# EAGLE design CM FT4232 with RS485 and ESP32 (EAGLE 9.6.2)
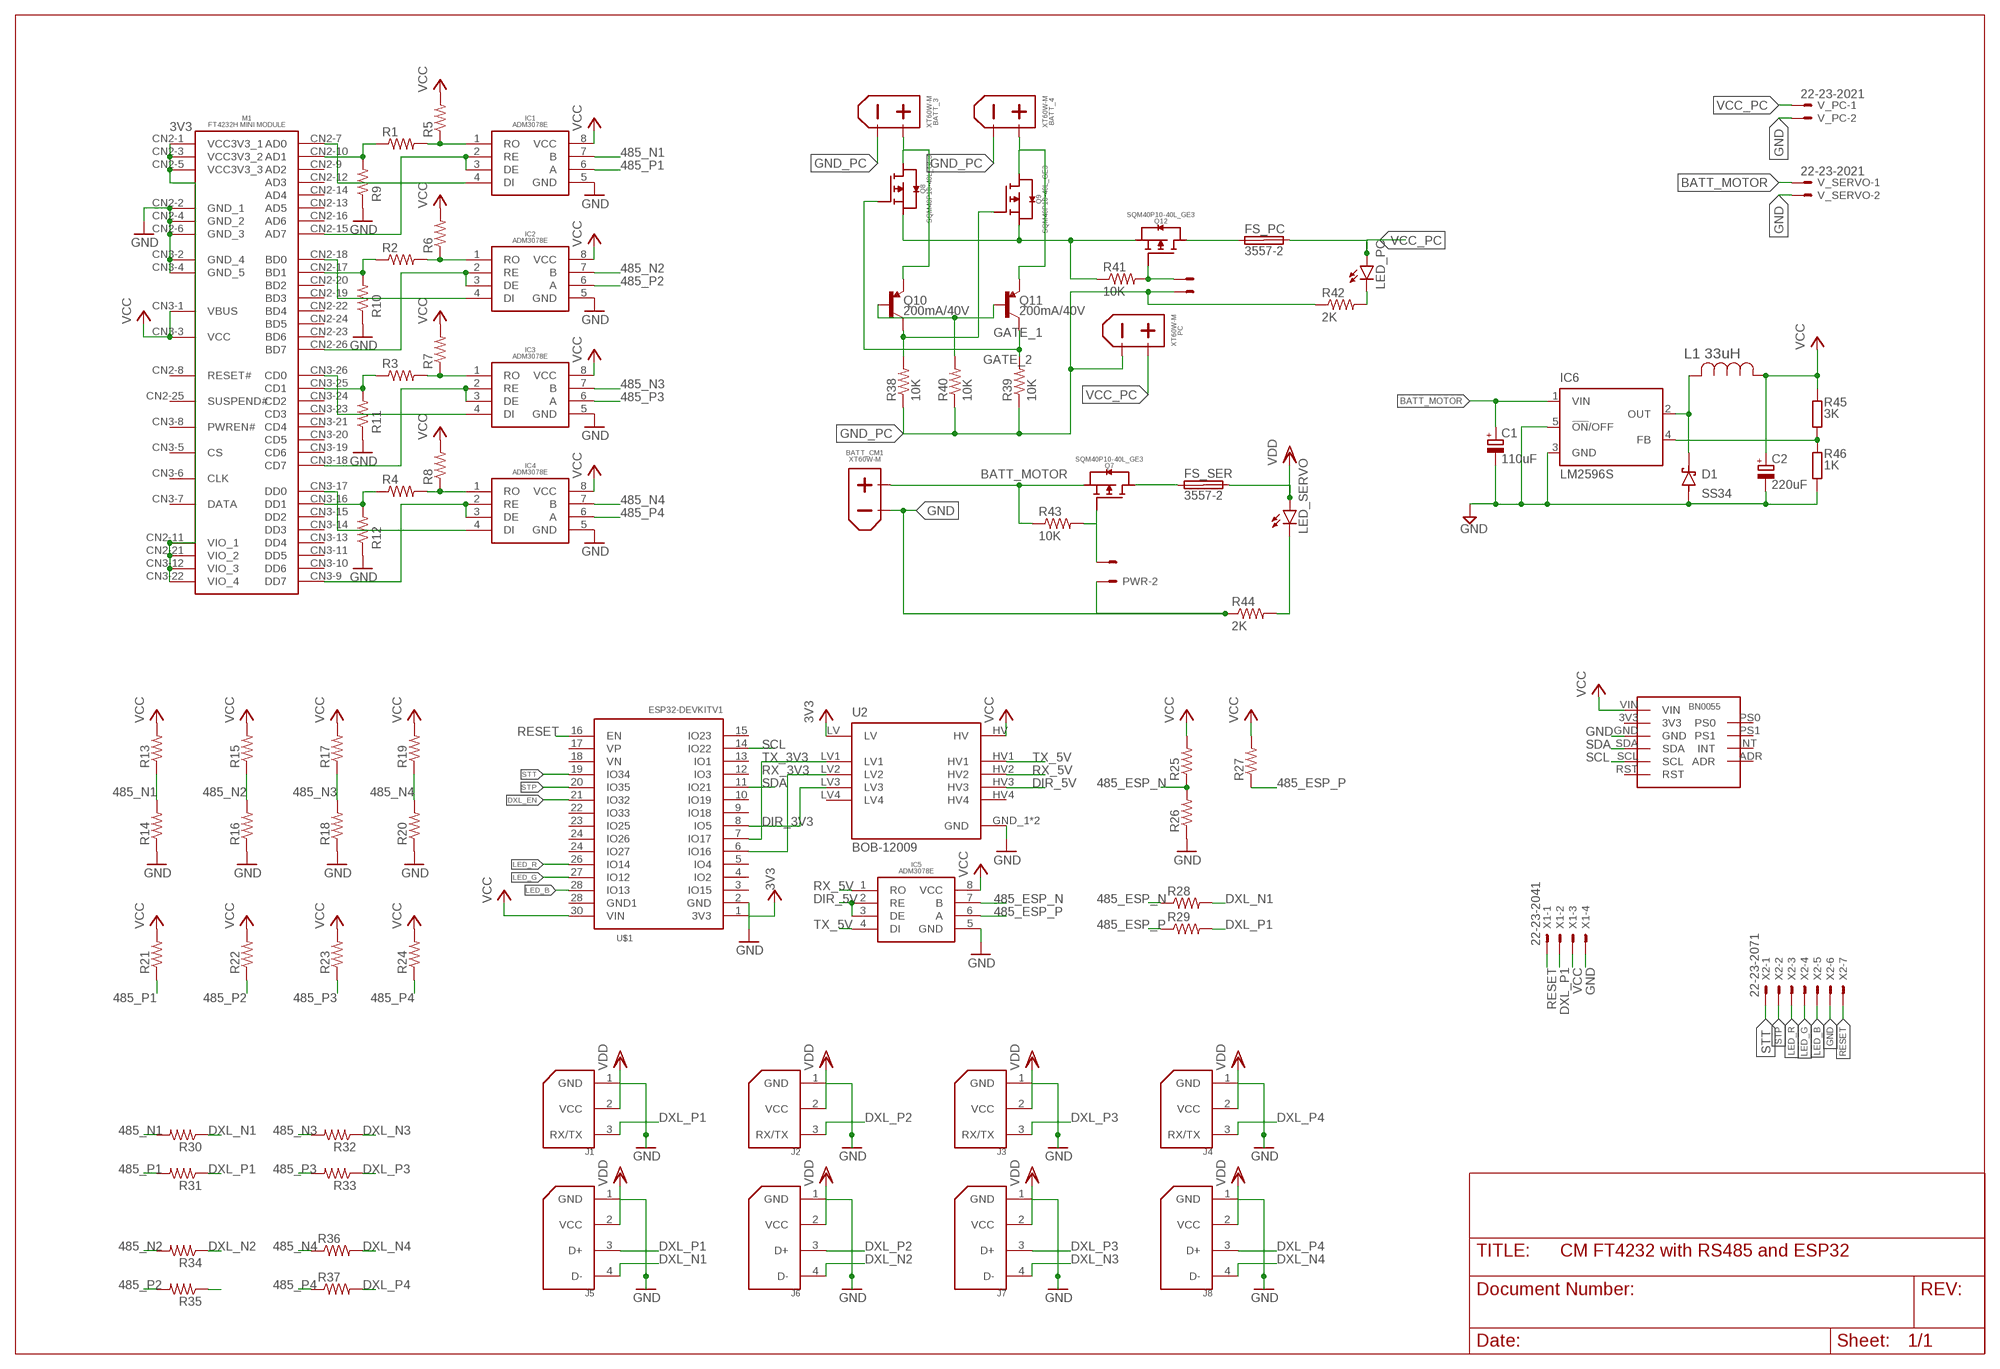
[diagram p0: schematic, sheet 1]

## Parts
BATT_3  XT60PW-M  [XT60PW-M]
BATT_4  XT60PW-M  [XT60PW-M]
BATT_CM1  XT60PW-M  [XT60PW-M]
C1  110uF  CPOL-EUE2.5-6  [E2,5-6]
C2  220uF  CPOL-EUE2.5-6  [E2,5-6]
D1  SS34  [DIOM6859X262N]
FS_PC  3557-2  [FUSE_3557-2]
FS_SER  3557-2  [FUSE_3557-2]
IC1  ADM3078E  [ADM3078E]
IC2  ADM3078E  [ADM3078E]
IC3  ADM3078E  [ADM3078E]
IC4  ADM3078E  [ADM3078E]
IC5  ADM3078E  [ADM3078E]
IC6  LM2596S  [TO263-5]
J1  22-03-5035  [5267-3]
J2  22-03-5035  [5267-3]
J3  22-03-5035  [5267-3]
J4  22-03-5035  [5267-3]
J5  22-03-5045  [5267-4]
J6  22-03-5045  [5267-4]
J7  22-03-5045  [5267-4]
J8  22-03-5045  [5267-4]
L1  33uH  CDRH127/LDNP-470MC  [IND_CDRH127/LDNP-470MC_SUM]
LED_PC  LEDCHIPLED_0805  [CHIPLED_0805]
LED_SERVO  LEDCHIPLED_0805  [CHIPLED_0805]
M1  FT4232H_MINI_MODULE  [FT4232H_MINI_MODULE]
PC  XT60PW-M  [XT60PW-M]
PWR  22-23-2021  [22-23-2021]
Q7  SQM40P10-40L_GE3  [TO-252-3]
Q8  SQM40P10-40L_GE3  [TO-252-3]
Q9  SQM40P10-40L_GE3  [TO-252-3]
Q10  200mA/40V  TRANS_PNP-PMBT3906|MMBT3906L  [SOT23-3]
Q11  200mA/40V  TRANS_PNP-PMBT3906|MMBT3906L  [SOT23-3]
Q12  SQM40P10-40L_GE3  [TO-252-3]
R1  RESISTOR0805  [0805]
R2  RESISTOR0805  [0805]
R3  RESISTOR0805  [0805]
R4  RESISTOR0805  [0805]
R5  RESISTOR0805  [0805]
R6  RESISTOR0805  [0805]
R7  RESISTOR0805  [0805]
R8  RESISTOR0805  [0805]
R9  RESISTOR0805  [0805]
R10  RESISTOR0805  [0805]
R11  RESISTOR0805  [0805]
R12  RESISTOR0805  [0805]
R13  RESISTOR0805  [0805]
R14  RESISTOR0805  [0805]
R15  RESISTOR0805  [0805]
R16  RESISTOR0805  [0805]
R17  RESISTOR0805  [0805]
R18  RESISTOR0805  [0805]
R19  RESISTOR0805  [0805]
R20  RESISTOR0805  [0805]
R21  RESISTOR0805  [0805]
R22  RESISTOR0805  [0805]
R23  RESISTOR0805  [0805]
R24  RESISTOR0805  [0805]
R25  RESISTOR0805  [0805]
R26  RESISTOR0805  [0805]
R27  RESISTOR0805  [0805]
R28  RESISTOR0805  [0805]
R29  RESISTOR0805  [0805]
R30  RESISTOR0805  [0805]
R31  RESISTOR0805  [0805]
R32  RESISTOR0805  [0805]
R33  RESISTOR0805  [0805]
R34  RESISTOR0805  [0805]
R35  RESISTOR0805  [0805]
R36  RESISTOR0805  [0805]
R37  RESISTOR0805  [0805]
R38  10K  R-US_M0805  [M0805]
R39  10K  R-US_M0805  [M0805]
R40  10K  R-US_M0805  [M0805]
R41  10K  R-US_M0805  [M0805]
R42  2K  R-US_M0805  [M0805]
R43  10K  R-US_M0805  [M0805]
R44  2K  R-US_M0805  [M0805]
R45  3K  R-EU_R1206  [R1206]
R46  1K  R-EU_R1206  [R1206]
SW_PC  22-23-2021  [22-23-2021]
U2  BOB-12009  [CONV_BOB-12009]
U$1  ESP32DEVKITV1  [ESP32-DEVKITV1]
U$2  BNO055  [BNO055]
V_PC  22-23-2021  [22-23-2021]
V_SERVO  22-23-2021  [22-23-2021]
X1  22-23-2041  [22-23-2041]
X2  22-23-2071  [22-23-2071]

## Nets
3V3: M1.CN2-1(VCC3V3_1) M1.CN2-3(VCC3V3_2) M1.CN2-5(VCC3V3_3) M1.CN2-11(VIO_1) M1.CN2-21(VIO_2) M1.CN3-12(VIO_3) M1.CN3-22(VIO_4) U2.LV U$1.1(3V3) ; supply symbol labelled VCC
485_ESP_N: IC5.7(B) R25.1 R26.2 R28.1
485_ESP_P: IC5.6(A) R27.1 R29.1
485_N1: IC1.7(B) R13.1 R14.2 R30.2
485_N2: IC2.7(B) R15.1 R16.2 R34.2
485_N3: IC3.7(B) R17.1 R18.2 R32.2
485_N4: IC4.7(B) R19.1 R20.2 R36.1
485_P1: IC1.6(A) R21.1 R31.2
485_P2: IC2.6(A) R22.1 R35.2
485_P3: IC3.6(A) R23.1 R33.2
485_P4: IC4.6(A) R24.1 R37.1
+3: Q8.3(S) Q9.3(S) Q12.3(S) R41.1
BATT_MOTOR: BATT_CM1.+ C1.+ IC6.1(VIN) Q7.3(S) R43.1 V_SERVO.1
DI1: IC1.4(DI) M1.CN2-7(AD0)
DIR_3V3: U2.LV3 U$1.8(IO5)
DIR_5V: IC5.2(RE) IC5.3(DE) U2.HV3
DXL_EN: U$1.21(IO32)
DXL_N1: J5.4(D-) R28.2 R30.1
DXL_N2: J6.4(D-) R34.1
DXL_N3: J7.4(D-) R32.1
DXL_N4: J8.4(D-) R36.2
DXL_P1: J1.3(RX/TX) J5.3(D+) R29.2 R31.1 X1.2
DXL_P2: J2.3(RX/TX) J6.3(D+) R35.1
DXL_P3: J3.3(RX/TX) J7.3(D+) R33.1
DXL_P4: J4.3(RX/TX) J8.3(D+) R37.2
GATE_1: Q9.1(G) Q10.3(C) R38.2
GATE_2: Q8.1(G) Q11.3(C) R39.2
GND: BATT_CM1.1(-) BATT_CM1.2(-) BATT_CM1.- C1.- C2.- D1.A IC1.5(GND) IC2.5(GND) IC3.5(GND) IC4.5(GND) IC5.5(GND) IC6.3(GND) IC6.5(!ON!/OFF) J1.1(GND) J2.1(GND) J3.1(GND) J4.1(GND) J5.1(GND) J6.1(GND) J7.1(GND) J8.1(GND) M1.CN2-2(GND_1) M1.CN2-4(GND_2) M1.CN2-6(GND_3) M1.CN3-2(GND_4) M1.CN3-4(GND_5) PWR.2 R9.1 R10.1 R11.1 R12.1 R14.1 R16.1 R18.1 R20.1 R26.1 R44.1 R46.1 U2.GND_1(GND) U2.GND_2(GND) U$1.2(GND) U$2.GND V_PC.2 V_SERVO.2 X1.4 X2.6
GND_PC: BATT_3.1(-) BATT_3.2(-) BATT_3.- BATT_4.1(-) BATT_4.2(-) BATT_4.- PC.1(-) PC.2(-) PC.- R38.1 R39.1 R40.1 R42.1 SW_PC.2
LED_B: U$1.28(IO13) X2.5
LED_G: U$1.27(IO12) X2.4
LED_R: U$1.26(IO14) X2.3
N$1: FS_PC.1(1A) Q12.4(D)
N$2: IC2.2(RE) IC2.3(DE) M1.CN2-26(BD7)
N$3: IC3.2(RE) IC3.3(DE) M1.CN3-18(CD7)
N$4: IC4.2(RE) IC4.3(DE) M1.CN3-9(DD7)
N$5: M1.CN2-10(AD1) R1.1 R9.2
N$6: FS_SER.1(1A) Q7.4(D)
N$7: M1.CN2-17(BD1) R2.1 R10.2
N$8: IC2.1(RO) R2.2 R6.1
N$9: IC3.1(RO) R3.2 R7.1
N$10: M1.CN3-25(CD1) R3.1 R11.2
N$11: M1.CN3-16(DD1) R4.1 R12.2
N$12: IC4.1(RO) R4.2 R8.1
N$14: IC2.4(DI) M1.CN2-18(BD0)
N$15: IC3.4(DI) M1.CN3-26(CD0)
N$16: IC4.4(DI) M1.CN3-17(DD0)
N$17: BATT_3.+ Q8.4(D) Q10.2(E)
N$18: BATT_4.+ Q9.4(D) Q11.2(E)
N$22: Q10.1(B) Q11.1(B) R40.2
N$23: Q12.1(G) R41.2 SW_PC.1
N$24: PWR.1 Q7.1(G) R43.2
N$25: LED_PC.C R42.2
N$26: LED_SERVO.C R44.2
N$27: IC6.4(FB) R45.1 R46.2
N$28: D1.C(K) IC6.2(OUT) L1.2
RE1: IC1.2(RE) IC1.3(DE) M1.CN2-15(AD7)
RESET: U$1.16(EN) X1.1 X2.7
RO1: IC1.1(RO) R1.2 R5.1
RX_3V3: U2.LV2 U$1.6(IO16)
RX_5V: IC5.1(RO) U2.HV2
SCL: U$1.14(IO22) U$2.SCL
SDA: U$1.11(IO21) U$2.SDA
STP: U$1.20(IO35) X2.2
STT: U$1.19(IO34) X2.1
TX_3V3: U2.LV1 U$1.7(IO17)
TX_5V: IC5.4(DI) U2.HV1
VCC: C2.+ IC1.8(VCC) IC2.8(VCC) IC3.8(VCC) IC4.8(VCC) IC5.8(VCC) L1.1 M1.CN3-1(VBUS) M1.CN3-3(VCC) R5.2 R6.2 R7.2 R8.2 R13.2 R15.2 R17.2 R19.2 R21.2 R22.2 R23.2 R24.2 R25.2 R27.2 R45.2 U2.HV U$1.30(VIN) U$2.VIN X1.3
VCC_PC: FS_PC.3(2A) LED_PC.A PC.+ V_PC.1
VDD: FS_SER.3(2A) J1.2(VCC) J2.2(VCC) J3.2(VCC) J4.2(VCC) J5.2(VCC) J6.2(VCC) J7.2(VCC) J8.2(VCC) LED_SERVO.A
Unconnected: FS_PC.2(1B) FS_PC.4(2B) FS_SER.2(1B) FS_SER.4(2B) M1.CN2-8(RESET#) M1.CN2-9(AD2) M1.CN2-12(AD3) M1.CN2-13(AD5) M1.CN2-14(AD4) M1.CN2-16(AD6) M1.CN2-19(BD3) M1.CN2-20(BD2) M1.CN2-22(BD4) M1.CN2-23(BD6) M1.CN2-24(BD5) M1.CN2-25(SUSPEND#) M1.CN3-5(CS) M1.CN3-6(CLK) M1.CN3-7(DATA) M1.CN3-8(PWREN#) M1.CN3-10(DD6) M1.CN3-11(DD5) M1.CN3-13(DD4) M1.CN3-14(DD3) M1.CN3-15(DD2) M1.CN3-19(CD6) M1.CN3-20(CD5) M1.CN3-21(CD4) M1.CN3-23(CD3) M1.CN3-24(CD2) U2.HV4 U2.LV4 U$1.3(IO15) U$1.4(IO2) U$1.5(IO4) U$1.9(IO18) U$1.10(IO19) U$1.12(IO3) U$1.13(IO1) U$1.15(IO23) U$1.17(VP) U$1.18(VN) U$1.22(IO33) U$1.23(IO25) U$1.24(IO26) U$1.24(IO27) U$1.28(GND1) U$2.3V3 U$2.ADR U$2.INT U$2.PS0 U$2.PS1 U$2.RST

## Library data of the parts
BATT_3 BATT_4 BATT_CM1 PC = AMASS_XT60:XT60PW-M
C1 C2 = rcl:CPOL-EU: POLARIZED CAPACITOR, European symbol; SPICEPREFIX: C
D1 = SS34:SS34: Check availability <https://pricing.snapeda.com/parts/SS34/Taiwan%20Semiconductor/view-part?ref=eda>; AVAILABILITY: In Stock; DESCRIPTION: 3A, 40V, Schottky Rectifier; MF: Taiwan Semiconductor; MP: SS34; PACKAGE: SMC-2 Taiwan Semiconductor; PRICE: None; PURCHASE-URL: https://pricing.snapeda.com/search/part/SS34/?ref=eda
FS_PC FS_SER = 3557-2:3557-2: Clip; Auto Clips & Holders; 2-1 Holder For Standard & Low Profile Mini Fuses Check availability <https://pricing.snapeda.com/parts/3557-2/Keystone%20Electronics/view-part?ref=eda>; AVAILABILITY: In Stock; DESCRIPTION: THM 2 in 1 Auto Blade Holder; MF: Keystone Electronics; MP: 3557-2; PACKAGE: Nonstandard Keystone; PRICE: None; PURCHASE-URL: https://pricing.snapeda.com/search/part/3557-2/?ref=eda
IC1-IC5 = ADM3078E:ADM3078E
IC6 = national-semiconductor:LM2596: SIMPLE SWITCHER® Power Converter 150 kHz 3A Step-Down Voltage Regulator Source: http://www.national.com/ds/LM/LM2596.pdf; MF: NATIONAL SEMICONDUCTOR; MPN: LM2596S-ADJ/NOPB; OC_FARNELL: 9494367; OC_NEWARK: 41K3842
J1-J4 = molex:22-03-5035: Molex SPOX Vert, Tin (Dynamixel AX/MX Bus) tested: YES (arbotix)
J5-J8 = molex:22-03-5045: Molex SPOX Vert, Tin (Dynamixel RX Bus) tested: YES (arbotix2)
L1 = CDRH127_LDNP-470MC:CDRH127/LDNP-470MC: Check availability <https://pricing.snapeda.com/parts/CDRH127/LDNP-470MC/Sumida%20America/view-part?ref=eda>; AVAILABILITY: In Stock; DESCRIPTION: 47 µH Shielded - Inductor 3.25 A 78mOhm Max Nonstandard; MF: Sumida America; MP: CDRH127/LDNP-470MC; PACKAGE: Nonstandard Sumida; PRICE: None; PURCHASE-URL: https://pricing.snapeda.com/search/part/CDRH127/LDNP-470MC/?ref=eda
LED_PC LED_SERVO = led:LED: LED OSRAM: - CHIPLED LG R971, LG N971, LY N971, LG Q971, LY Q971, LO R971, LY R971 LH N974, LH R974 LS Q976, LO Q976, LY Q976 LO Q996 - Hyper CHIPLED LW Q18S LB Q993, LB Q99A, LB R99A - SideLED LS A670, LO A670, LY A670, LG A670, LP A670 LB A673, LV A673, LT A673, LW A673 LH A674 LY A675 LS A676, LA A676, LO A676, LY A676, LW A676 LS A679, LY A679, LG A679 - Hyper Micro SIDELED® LS Y876, LA Y876, LO Y876, LY Y876 LT Y87S - SmartLED LW L88C, LW L88S LB L89C, LB L89S, LG L890 LS L89K, LO L89K, LY L89K LS L896, LA L896, LO L896, LY L896 - TOPLED LS T670, LO T670, LY T670, LG T670, LP T670 LSG T670, LSP T670, LSY T670, LOP T670, LYG T670 LG T671, LOG T671, LSG T671 LB T673, LV T673, LT T673, LW T673 LH T674 LS T676, LA T676, LO T676, LY T676, LB T676, LH T676, LSB T676, LW T676 LB T67C, LV T67C, LT T67C, LS T67K, LO T67K, LY T67K, LW E67C LS E67B, LA E67B, LO E67B, LY E67B, LB E67C, LV E67C, LT E67C LW T67C LS T679, LY T679, LG T679 LS T770, LO T770, LY T770, LG T770, LP T770 LB T773, LV T773, LT T773, LW T773 LH T774 LS E675, LA E675, LY E675, LS T675 LS T776, LA T776, LO T776, LY T776, LB T776 LHGB T686 LT T68C, LB T68C - Hyper Mini TOPLED® LB M676 - Mini TOPLED Santana® LG M470 LS M47K, LO M47K, LY M47K Source: http://www.osram.convergy.de LUXEON: - LUMILED® LXK2-PW12-R00, LXK2-PW12-S00, LXK2-PW14-U00, LXK2-PW14-V00 LXK2-PM12-R00, LXK2-PM12-S00, LXK2-PM14-U00 LXK2-PE12-Q00, LXK2-PE12-R00, LXK2-PE12-S00, LXK2-PE14-T00, LXK2-PE14-U00 LXK2-PB12-K00, LXK2-PB12-L00, LXK2-PB12-M00, LXK2-PB14-N00, LXK2-PB14-P00, LXK2-PB14-Q00 LXK2-PR12-L00, LXK2-PR12-M00, LXK2-PR14-Q00, LXK2-PR14-R00 LXK2-PD12-Q00, LXK2-PD12-R00, LXK2-PD12-S00 LXK2-PH12-R00, LXK2-PH12-S00 LXK2-PL12-P00, LXK2-PL12-Q00, LXK2-PL12-R00 Source: www.luxeon.com KINGBRIGHT: KA-3528ASYC Source: www.kingbright.com
M1 = FT4232H_MINI_MODULE:FT4232H_MINI_MODULE
PWR SW_PC V_PC V_SERVO = con-molex:22-23-2021: .100" (2.54mm) Center Header - 2 Pin; MF: MOLEX; MPN: 22-23-2021; OC_FARNELL: 1462926; OC_NEWARK: 25C3832
Q7-Q9 Q12 = Vishay_FET:SQM40P10-40L_GE3
Q10 Q11 = SparkFun-DiscreteSemi:TRANS_PNP: PNP transistor Current controlled devices typically used to amplify current or used as a switch. SparkFun Products: SparkFun Serial Enabled 16x2 LCD - Red on Black <https://www.sparkfun.com/products/9068> SparkFun Logomatic <https://www.sparkfun.com/products/12772>; PROD_ID: TRANS-08052
R1-R37 = SparkFun-Resistors:RESISTOR: Generic Resistor Package
R38-R44 = rcl:R-US_: RESISTOR, American symbol; SPICEPREFIX: R
R45 R46 = rcl:R-EU_: RESISTOR, European symbol; SPICEPREFIX: R
U2 = BOB-12009:BOB-12009: Logic Level Converter - Bi-Direc Check availability <https://pricing.snapeda.com/parts/BOB-12009/SparkFun/view-part?ref=eda>; AVAILABILITY: In Stock; DESCRIPTION: BSS138 Logic-Level Translator Interface Evaluation Board; MF: SparkFun; MP: BOB-12009; PACKAGE: None; PRICE: None; PURCHASE-URL: https://pricing.snapeda.com/search/part/BOB-12009/?ref=eda
U$1 = ESP32-DEVKITV1:ESP32DEVKITV1
U$2 = BNO055:BNO055
X1 = con-molex:22-23-2041: .100" (2.54mm) Center Header - 4 Pin; MF: MOLEX; MPN: 22-23-2041; OC_FARNELL: 1462920; OC_NEWARK: 38C0355
X2 = con-molex:22-23-2071: .100" (2.54mm) Center Header - 7 Pin; MF: MOLEX; MPN: 22-23-2071; OC_FARNELL: 1654534; OC_NEWARK: 56H0445

## Net classes
4 Battery-Power: width 2.54 mm, drill 1.27 mm, clearance 0.203 mm

## Board
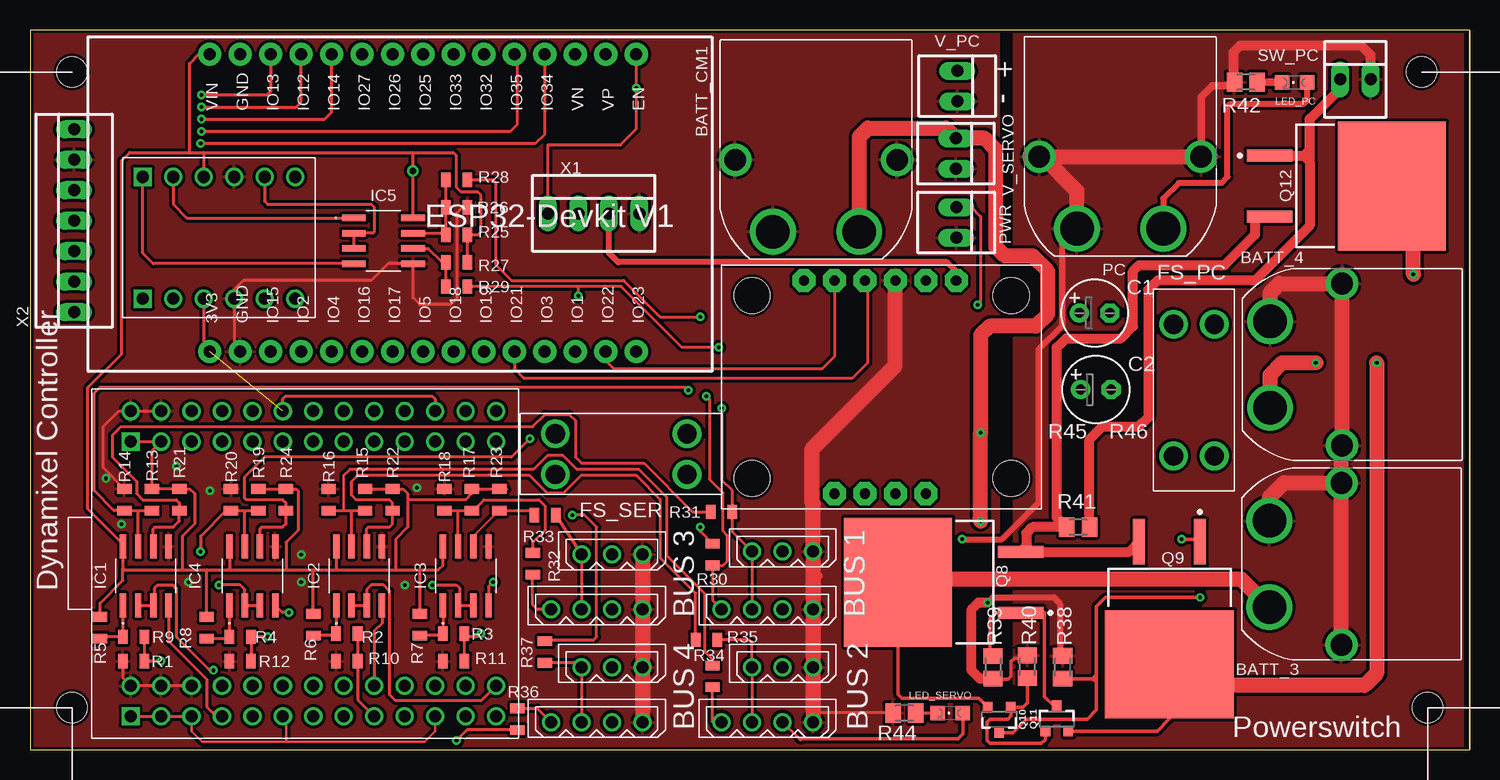
[diagram p1: board, top side]
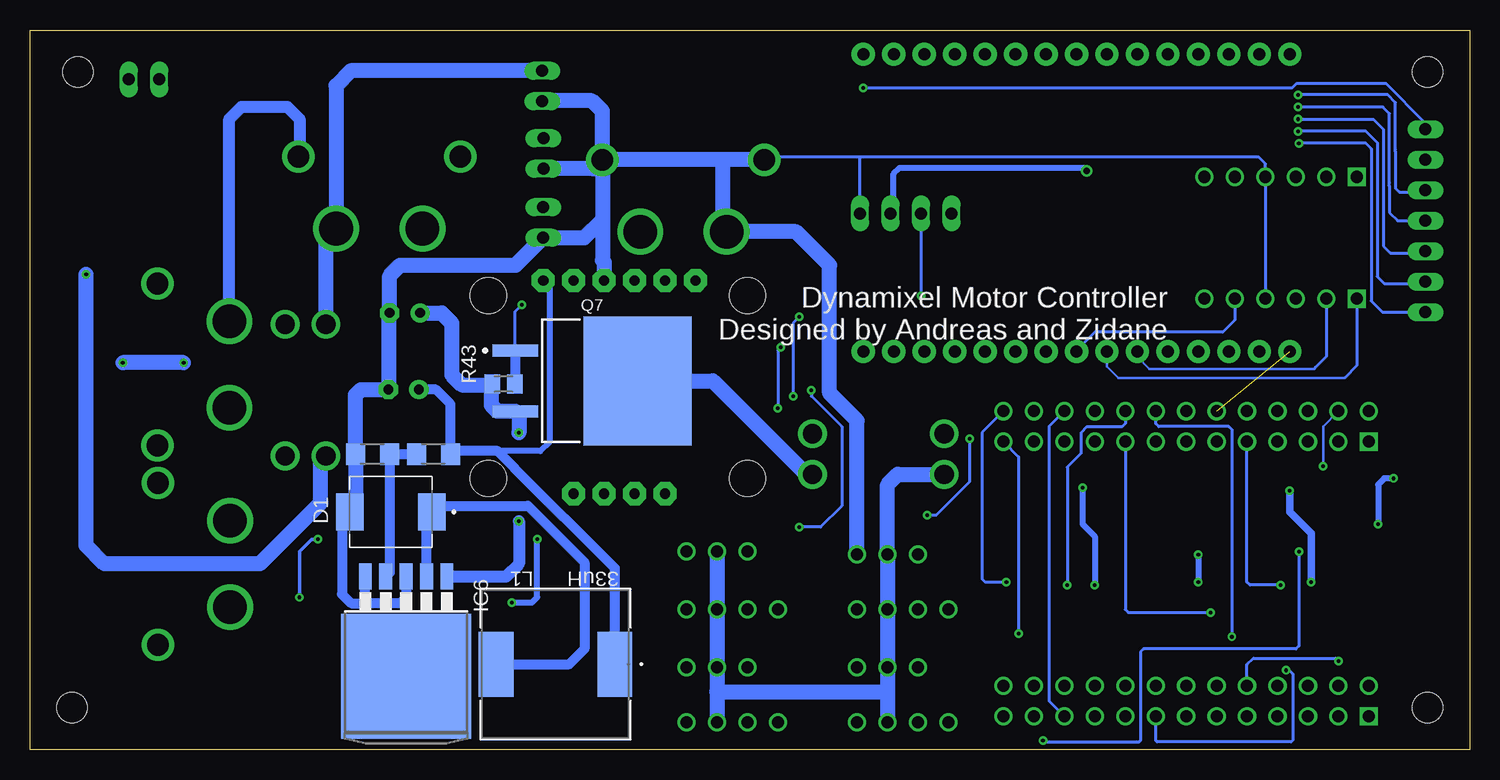
[diagram p2: board, bottom side, seen from below]

Size 120 x 60 mm. Coordinates in mm from the lower left corner, seen from the top.
Outline: 0,0 120,0 120,60 0,60 0,0
Copper layers (1*16): Top 0.035mm / dielectric 1.5mm / Bottom 0.035mm
Design rules "default *": minimum track width 6mil, minimum drill 0.35mm, track to track 10mil, track to pad 10mil, pad to pad 10mil, via to via 10mil, smd to smd 10mil, copper to edge 10mil, drill to drill 0.4mm, minimum pad ring 10mil, minimum via ring 8mil, stop-mask expansion 4mil, vias tented up to drill 0mil, thermal gap 10mil
Holes 2.5 mm at 3.5,56.5 3.5,3.5 116,56.5 116.5,3.5

### Footprints (pad centres in the part's own frame; a part is rotated, then mirrored left to right if it is on the bottom)
XT60PW-M = drill 1.8: 1 -6.75,-10; 2 6.75,-10 | drill 2.8: + 3.6,-16; - -3.6,-16
E2,5-6 = drill 0.813 pad 1.6: + -1.27,0 | drill 0.813 pad 1.6 octagon: - 1.27,0
DIOM6859X262N = smd 2.29 x 3.12: A 3.43,0; C -3.43,0
FUSE_3557-2 = drill 1.6: 1 -5.485,1.7; 2 -5.485,-1.7; 3 5.485,1.7; 4 5.485,-1.7
ADM3078E = smd 1.981 x 0.533: 1 -2.464,1.905; 2 -2.464,0.635; 3 -2.464,-0.635; 4 -2.464,-1.905; 5 2.464,-1.905; 6 2.464,-0.635; 7 2.464,0.635; 8 2.464,1.905
TO263-5 = smd 1.067 x 2.159: 1 -3.404,-5.791; 2 -1.702,-5.791; 3 0,-5.791; 4 1.702,-5.791; 5 3.404,-5.791 | smd 10.8 x 10.41: 6 0,2.54
5267-3 = drill 1: 1 0,0; 2 -2.54,0; 3 -5.08,0
5267-4 = drill 1: 1 0,0; 2 -2.54,0; 3 -5.08,0; 4 -7.62,0
IND_CDRH127/LDNP-470MC_SUM = smd 2.896 x 5.41: 1 -4.953,0; 2 4.953,0
CHIPLED_0805 = smd 1.2 x 1.2: A 0,-1.05; C 0,1.05
FT4232H_MINI_MODULE = drill 1 square: CN2-1 -12.715,16.51; CN3-1 10.175,16.51 | drill 1: CN2-2 -10.175,16.51; CN2-3 -12.715,13.97; CN2-4 -10.175,13.97; CN2-5 -12.715,11.43; CN2-6 -10.175,11.43; CN2-7 -12.715,8.89; CN2-8 -10.175,8.89; CN2-9 -12.715,6.35; CN2-10 -10.175,6.35; CN2-11 -12.715,3.81; CN2-12 -10.175,3.81; CN2-13 -12.715,1.27; CN2-14 -10.175,1.27; CN2-15 -12.715,-1.27; CN2-16 -10.175,-1.27; CN2-17 -12.715,-3.81; CN2-18 -10.175,-3.81; CN2-19 -12.715,-6.35; CN2-20 -10.175,-6.35; CN2-21 -12.715,-8.89; CN2-22 -10.175,-8.89; CN2-23 -12.715,-11.43; CN2-24 -10.175,-11.43; CN2-25 -12.715,-13.97; CN2-26 -10.175,-13.97; CN3-2 12.715,16.5; CN3-3 10.175,13.97; CN3-4 12.715,13.97; CN3-5 10.175,11.43; CN3-6 12.715,11.43; CN3-7 10.175,8.89; CN3-8 12.715,8.89; CN3-9 10.175,6.35; CN3-10 12.715,6.35; CN3-11 10.175,3.81; CN3-12 12.715,3.81; CN3-13 10.175,1.27; CN3-14 12.715,1.27; CN3-15 10.175,-1.27; CN3-16 12.715,-1.27; CN3-17 10.175,-3.81; CN3-18 12.715,-3.81; CN3-19 10.175,-6.35; CN3-20 12.715,-6.35; CN3-21 10.175,-8.89; CN3-22 12.715,-8.89; CN3-23 10.175,-11.43; CN3-24 12.715,-11.43; CN3-25 10.175,-13.97; CN3-26 12.715,-13.97
22-23-2021 = drill 1 long: 1 -1.27,0; 2 1.27,0
TO-252-3 = smd 3.8 x 1: 1 -6.4,2.54; 3 -6.4,-2.54 | smd 9 x 10.75: 4 3.8,0
SOT23-3 = smd 0.8 x 0.9: 1 -0.95,-1; 2 0.95,-1; 3 0,1.1
0805 = smd 0.8 x 1.2: 1 -0.9,0; 2 0.9,0
M0805 = smd 1.3 x 1.6: 1 -0.95,0; 2 0.95,0
R1206 = smd 1.6 x 1.803: 1 -1.422,0; 2 1.422,0
CONV_BOB-12009 = drill 1.016: GND_1 5.08,-1.27; GND_2 -5.08,-1.27; HV 5.08,1.27; HV2 5.08,3.81; HV3 5.08,-3.81; HV4 5.08,-6.35; LV -5.08,1.27; LV2 -5.08,3.81; LV3 -5.08,-3.81; LV4 -5.08,-6.35 | drill 1.016 square: HV1 5.08,6.35; LV1 -5.08,6.35
ESP32-DEVKITV1 = drill 1 pad 1.93: 1 -22.87,-13.54; 2 -20.33,-13.54; 3 -17.79,-13.54; 4 -15.25,-13.54; 5 -12.71,-13.54; 6 -10.17,-13.54; 7 -7.63,-13.54; 8 -5.09,-13.54; 9 -2.55,-13.54; 10 -0.01,-13.54; 11 2.53,-13.54; 12 5.07,-13.54; 13 7.61,-13.54; 14 10.15,-13.54; 15 12.69,-13.54; 16 12.69,11.23; 17 10.15,11.23; 18 7.61,11.23; 19 5.07,11.23; 20 2.53,11.23; 21 -0.01,11.23; 22 -2.55,11.23; 23 -5.09,11.23; 24 -7.63,11.23; 25 -10.17,11.23; 26 -12.71,11.23; 27 -15.25,11.23; 28 -17.79,11.23; 29 -20.33,11.23; 30 -22.87,11.23
BNO055 = drill 0.85 pad 1.93 octagon: 3V3 9.652,1.27; ADR 17.272,19.05; GND 12.192,1.27; INT 14.732,19.05; PS0 9.652,19.05; PS1 12.192,19.05; RST 19.812,1.27; SCL 17.272,1.27; SDA 14.732,1.27; VIN 7.112,1.27 | hole 3: 2.54,2.54; 2.54,17.78; 24.13,2.54; 24.13,17.78
22-23-2041 = drill 1 long: 1 -3.81,0; 2 -1.27,0; 3 1.27,0; 4 3.81,0
22-23-2071 = drill 1 long: 1 -7.62,0; 2 -5.08,0; 3 -2.54,0; 4 0,0; 5 2.54,0; 6 5.08,0; 7 7.62,0

### Placement (x,y rotation side)
BATT_3  119.32,15.48 270 top
BATT_4  119.38,32.11 270 top
BATT_CM1  65.53,59.18 0 top
C1  88.75,36.41 0 top
C2  88.85,30.02 0 top
D1  89.92,19.81 180 bottom
FS_PC  97.03,29.97 90 top
FS_SER  49.28,24.64 180 top
IC1  9.65,14.48 90 top
IC2  27.43,14.48 90 top
IC3  36.32,14.48 90 top
IC4  18.54,14.48 90 top
IC5  29.46,42.42 0 top
IC6  88.65,8.64 180 bottom
J1  65.28,16.51 0 top
J2  65.28,6.86 0 top
J3  51.05,16.26 0 top
J4  51.05,6.86 0 top
J5  65.28,11.68 0 top
J6  65.28,2.29 0 top
J7  51.05,11.68 0 top
J8  51.05,2.29 0 top
L1  76.2,7.11 180 bottom
LED_PC  105.42,55.62 90 top
LED_SERVO  76.71,3.05 90 top
M1  24.89,15.49 90 top
PC  90.88,59.44 0 top
PWR  77.22,43.94 270 top
Q7  73.15,30.73 0 bottom
Q8  76.17,13.95 180 top
Q9  95,10.92 270 top
Q10  80.79,2.51 180 top
Q11  85.6,2.54 0 top
Q12  109.73,46.99 0 top
R1  8.64,9.4 180 top
R2  26.42,9.65 180 top
R3  35.31,9.65 180 top
R4  17.53,9.4 180 top
R5  5.84,10.16 90 top
R6  23.62,10.41 90 top
R7  32.51,10.41 90 top
R8  14.73,10.16 90 top
R9  8.64,7.37 0 top
R10  26.42,7.37 0 top
R11  35.31,7.37 0 top
R12  17.53,7.37 0 top
R13  10.16,20.83 90 top
R14  7.87,20.83 270 top
R15  27.94,20.83 90 top
R16  24.89,20.83 270 top
R17  36.83,20.83 90 top
R18  34.54,20.83 270 top
R19  19.05,20.83 90 top
R20  16.76,20.83 270 top
R21  12.45,20.83 90 top
R22  30.23,20.83 90 top
R23  39.12,20.83 90 top
R24  21.34,20.83 90 top
R25  35.56,42.93 0 top
R26  35.56,45.21 180 top
R27  35.56,40.64 0 top
R28  35.56,47.5 0 top
R29  35.56,38.61 0 top
R30  56.9,16.26 90 top
R31  57.66,19.81 180 top
R32  41.91,15.49 90 top
R33  42.93,19.56 180 top
R34  56.9,6.1 90 top
R35  56.39,9.14 180 top
R36  40.64,2.54 90 top
R37  42.93,8.13 270 top
R38  86.09,6.86 270 top
R39  80.26,6.86 90 top
R40  83.14,6.91 270 top
R41  87.38,18.54 0 top
R42  101.35,55.64 0 top
R43  80.52,30.48 0 bottom
R44  72.9,3.05 0 top
R45  86.36,24.64 0 bottom
R46  91.44,24.64 0 bottom
SW_PC  110.5,55.88 0 top
U2  15.75,42.67 90 top
U$1  37.85,46.74 0 top
U$2  84.33,40.39 180 top
V_PC  77.3,55.32 270 top
V_SERVO  77.19,49.7 270 top
X1  46.99,44.7 0 top
X2  3.68,44.09 90 top

### Tracks (layer width: path | path; a pad name or v marks a point on that pad's centre or on a via)
3V3  (1 unrouted)
  Top 0.203: M1.CN2-5 13.46,1.52 14.35,0.64 21.34,0.64 | 21.34,0.64 32.89,0.64 33.78,1.52 M1.CN2-21 | M1.CN2-11 21.34,2.52 21.34,0.64
  Top 0.254: M1.CN2-1 M1.CN2-3 M1.CN2-5 | M1.CN3-12 21.08,29.21 21.34,29.46 33.53,29.46 33.78,29.21 M1.CN3-22 | U$1.1 14.47,33.7 14.47,37.58 U2.LV
  Bottom 0.254: M1.CN3-22 35.05,26.94 35.05,4.05 M1.CN2-21
485_ESP_N
  Top 0.254: 34.66,43.05 R25.1 | IC5.7 34.66,43.05 | R28.1 R26.2 34.66,43.05
485_ESP_P
  Top 0.254: IC5.6 33.2,41.78 34.34,40.64 R27.1 R29.1
485_N1  (via drill 0.3 pad 0.55)
  Top 0.254: 8.89,19.93 R14.2 7,19.93 5.33,21.59 5.33,29.72 5.84,30.23 54.61,30.23 v54.86,29.97 | 8.89,19.93 R13.1 | IC1.7 9.02,19.8 8.89,19.93 | v55.88,18.54 55.88,18.17 R30.2
  Bottom 0.254: v54.86,29.97 54.86,29.46 52.32,26.92 52.32,20.32 54.1,18.54 v55.88,18.54
485_N2
  Top 0.203: 26.16,19.93 26.16,22.86
  Top 0.254: R16.2 26.16,19.93 26.92,19.93 | 26.92,19.93 R15.1 | IC2.7 26.8,19.8 26.92,19.93 | R34.2 56.9,7.5 56.27,8.13 56.27,12.97 53.09,16.15 53.09,21.04 50.76,23.37 45.6,23.37 44.45,24.52 43.14,24.52 41.98,23.37 26.67,23.37 26.16,22.86
485_N3
  Top 0.254: R18.2 35.81,19.93 | 35.81,19.93 R17.1 36.95,19.93 37.85,20.83 42.42,20.83 42.93,20.32 42.93,18.29 41.91,17.27 R32.2 | IC3.7 35.69,19.8 35.81,19.93
485_N4  (via drill 0.3 pad 0.55)
  Top 0.254: 18.03,19.93 R20.2 16.37,19.93 14.22,17.78 v14.22,16.51 | 18.03,19.93 R19.1 | IC4.7 17.91,19.8 18.03,19.93 | R36.1 36.44,1.64 v35.56,0.76
  Bottom 0.254: v14.22,16.51 14.22,8.64 14.48,8.38 27.18,8.38 27.43,8.13 27.43,0.76 27.56,0.64 35.43,0.64 v35.56,0.76
485_P1
  Top 0.254: IC1.6 10.29,18.41 10.41,18.54 11.94,18.54 12.45,19.05 R21.1 12.45,20.57 12.19,20.83 9.4,20.83 8.89,21.34 8.89,22.35 6.86,24.38 6.86,26.19 7.59,26.92 41.91,26.92 42.93,27.94 44.96,27.94 45.47,27.43 45.47,24.38 45.97,23.88 51.17,23.88 55.23,19.81 R31.2
485_P2
  Top 0.254: IC2.6 28.07,18.41 28.19,18.54 29.97,18.54 30.23,18.8 R22.1 30.23,20.57 29.97,20.83 27.18,20.83 26.8,21.21 26.8,22.35 27.3,22.86 41.63,22.86 43.14,21.36 44.45,21.36 45.95,22.86 50.55,22.86 52.58,20.82 52.58,15.94 55.49,13.03 R35.2
485_P3
  Top 0.203: IC3.6 36.96,17.77 R23.1
  Top 0.254: R23.1 41.66,19.93 R33.2
485_P4  (via drill 0.3 pad 0.55)
  Top 0.254: IC4.6 19.18,18.41 19.3,18.54 21.08,18.54 21.34,18.8 R24.1 21.34,20.57 21.08,20.83 18.03,20.83 17.91,20.95 17.91,22.73 19.55,24.38 40.13,24.38 v41.66,25.91 | R37.1 43.04,9.14 46.99,9.14 47.24,9.4 47.24,18.54 46.23,19.56 v45.21,19.56
  Bottom 0.254: v41.66,25.91 41.66,22.35 44.45,19.56 v45.21,19.56
+3
  Top 0.305: 84.07,16.49 Q8.3
  Top 0.813: Q8.3 82.27,16.49 | Q8.3 83.06,16.98 83.06,18.03 83.57,18.54 R41.1 85.6,19.37 85.6,33.53 86.36,34.29 90.93,34.29 91.95,35.31 91.95,39.88 92.46,40.39 99.57,40.39 102.11,42.93 102.11,44.45 Q12.3 | Q8.3 91.63,16.49 Q9.3
BATT_MOTOR  (via drill 0.3 pad 0.55)
  Top 1.27: BATT_CM1.+ 69.13,51.1 69.85,51.82 76.35,51.82 V_SERVO.1 79.59,50.97 80.52,50.04 80.52,41.91 81.28,41.15 83.57,41.15 84.84,39.88 84.84,36.32 83.82,35.31 80.01,35.31 79.25,34.54 v79.25,26.42 v79.25,19.05
  Bottom 1.016: IC6.1 80.31,14.43 79.25,15.49 v79.25,19.05
  Bottom 1.27: v79.25,26.42 79.25,27.89 Q7.3 81.03,28.19 81.53,28.7 81.53,30.41 | 81.53,30.41 R43.1 | C1.+ 85.68,36.41 84.84,35.56 84.84,31.24 84.01,30.41 81.53,30.41
DI1
  Top 0.254: IC1.4 11.56,9.02 14.73,5.84 14.73,3.56 15.51,2.78 M1.CN2-7
DIR_3V3
  Bottom 0.254: U2.LV3 19.56,35.81 20.57,34.8 31.24,34.8 32.76,33.28 U$1.8
DIR_5V
  Top 0.254: U2.HV3 19.56,45.72 19.81,45.47 28.45,45.47 28.7,45.21 28.7,43.18 28.57,43.05 IC5.2 IC5.3
DXL_N1  (via drill 0.3 pad 0.55)
  Top 0.254: J5.4 56.9,12.45 R30.1 57.77,15.36 58.17,15.75 58.17,17.82 57.78,18.21 57.78,21.4 56.65,22.53 56.65,29.21 v56.39,29.46 | R28.2 38.61,47.5 38.86,47.24 38.86,40.39 40.13,39.12 49.49,39.12 52.53,36.07 v55.88,36.07
  Bottom 0.254: v55.88,36.07 56.39,35.56 v56.39,29.47 v56.39,29.46
DXL_N2
  Top 0.254: J6.4 56.9,2.29 R34.1
DXL_N3
  Top 0.254: J7.4 42.28,11.68 41.91,12.05 R32.1
DXL_N4
  Top 0.254: R36.2 42.28,3.44 J8.4
DXL_P1  (via drill 0.3 pad 0.55)
  Top 0.254: J5.3 J1.3 58.56,18.15 R31.1 58.56,21.59 57.66,22.49 v57.66,28.45 | 45.72,38.61 49.28,38.61 54.36,33.53 v57.4,33.53 | 45.72,38.61 R29.2 | v45.72,37.85 45.72,38.61
  Bottom 0.254: v57.66,28.45 57.66,33.27 v57.4,33.53 | X1.2 v45.72,37.85
DXL_P2
  Top 0.254: R35.1 59.81,9.14 60.2,8.95 J2.3 J6.3
DXL_P3
  Top 0.254: R33.1 J3.3 J7.3
DXL_P4
  Top 0.254: R37.2 45.6,7.23 J4.3 J8.3
GATE_1  (via drill 0.3 pad 0.55)
  Top 0.305: 86.38,5.62 R38.2 88.58,5.91 | v97.54,12.69 89.65,12.69 88.9,11.94 88.9,6.1 | Q9.1 97.33,17.53 v96.01,17.53 | 88.9,5.59 88.9,3.3 88.14,2.54 83.06,2.54 81.93,1.41 Q10.3 | 88.9,5.59 88.9,6.1 | 88.9,5.59 88.58,5.91 | 88.58,5.91 88.76,6.1 88.9,6.1
  Bottom 0.305: v96.01,17.53 96.52,17.53 97.54,16.51 v97.54,12.69
GATE_2
  Top 0.305: Q8.1 82.28,11.41 82.3,11.43 82.04,11.43 81.72,11.11 | Q11.3 85.34,3.64 84.58,4.4 84.58,11.43 82.59,11.43 Q8.1 | R39.2 80.01,8.06 80.01,10.92 80.5,11.41 Q8.1
GND  (via drill 0.3 pad 0.55)
  Top 0.254: M1.CN2-6 M1.CN2-4 M1.CN2-2 7.74,5.96 R9.1 | M1.CN3-4 M1.CN3-2 7.38,28.21 6.1,26.92 6.1,23.51 R14.1 | 17.01,37.58 17.01,33.7 U$1.2 | 17.01,37.58 U2.GND_2 | 17.01,37.58 17.01,38.34 17.78,39.12 28.45,39.12 29.84,40.51 IC5.5 31.93,37.67 32.51,37.08 35.05,37.08 35.56,37.59 35.56,44.7 36.07,45.21 R26.1 | R44.1 65.53,3.05 65.28,3.3
  Top 0.61: 65.79,14.48 65.28,13.97
  Top 1.27: J6.1 65.28,3.3 J2.1 J5.1 65.28,13.97 J1.1 65.28,20.49 65.2,20.57 65.2,25.07 72.14,32 U$2.GND | J3.1 J7.1 J4.1 J8.1
  Bottom 0.203: M1.CN3-4 12.19,26.94 v12.19,23.62
  Bottom 0.254: U2.GND_2 U2.GND_1 17.02,48.85 17.6,49.44 50.8,49.44 | 50.8,49.44 58.53,49.44 BATT_CM1.1 | X1.4 50.8,49.44
  Bottom 0.508: v22.61,16.26 v22.61,13.97 | v32.26,21.84 32.26,18.8 31.24,17.78 v31.24,13.72 | v6.35,22.61 7.11,22.61 7.62,22.1 v7.62,18.8
  Bottom 0.61: BATT_CM1.2 72.28,49.02 | 72.28,39.26 U$2.GND | v14.99,21.59 14.99,19.81 13.21,18.03 v13.21,13.97
  Bottom 0.813: IC6.3 88.65,12.7 89.15,12.19 91.95,12.19 | 91.95,12.19 92.05,12.29 IC6.5 | 91.95,12.19 93.22,12.19 93.98,12.95 93.98,19.81 D1.A
  Bottom 1.27: BATT_CM1.1 62.23,49.18 | 62.23,49.18 72.12,49.18 72.28,49.02 | 62.23,49.18 62.23,43.48 BATT_CM1.- 56.14,43.18 53.34,40.39 53.34,29.72 51.05,27.43 J3.1 | BATT_CM1.2 72.28,44.2 | 72.28,44.2 72.28,40.79 72.14,40.64 72.14,39.41 72.28,39.26 | BATT_CM1.2 73.03,48.43 V_SERVO.2 | 72.28,44.2 73.81,42.67 PWR.2 79.5,40.38 89.15,40.38 90.02,39.52 C1.- 90.12,36.3 C2.- 92.41,30.02 92.86,29.57 R46.1 92.84,24.61 92.84,20.32 D1.A 93.12,20.04 | BATT_CM1.2 72.28,53.23 73.15,54.1 77.24,54.1 V_PC.2
  pour Top: 0,59.94 80.77,59.94 80.77,0.25 0,0.25
GND_PC  (via drill 0.3 pad 0.55)
  Top 0.305: 86.03,7.87 R38.1 85.92,7.98 85.85,7.98 | R40.1 82.9,7.62 82.04,7.62 81.79,7.37 81.79,6.1 81.53,5.84 80.33,5.84 R39.1
  Top 0.508: v79.82,12.26 80.26,12.7 85.34,12.7 85.85,12.19 85.85,7.98 | v77.72,17.53 81.03,17.53 84.07,20.57 84.07,33.38 86.01,35.31 86.01,42.17 PC.-
  Top 0.61: R42.1 100.13,55.37 98.55,55.37 97.63,54.45 PC.2
  Top 0.813: SW_PC.2 111.77,57.9 111,58.67 100.84,58.67 100.33,58.17 100.33,55.71 R42.1 | R39.1 79.18,5.91 78.49,6.6 78.49,11.68 79.06,12.26 v79.82,12.26
  Top 1.27: BATT_4.- 103.38,38.1 104.14,38.86 BATT_4.1 BATT_4.2 109.32,25.3 BATT_3.1 | BATT_3.2 BATT_3.1 | BATT_3.- 103.32,21.03 104.53,22.23 BATT_3.1 | PC.2 PC.1 84.42,49.44 87.28,46.58 PC.-
  Bottom 0.508: v79.82,12.26 78.17,12.26 77.72,12.7 v77.72,17.53
  Bottom 1.016: BATT_4.- 103.38,52.58 102.36,53.59 98.55,53.59 97.54,52.58 97.54,49.53 PC.2
  pour Top: 82.04,59.69 119.38,59.69 119.38,-0.25 82.04,-0.25
LED_B  (via drill 0.3 pad 0.55)
  Top 0.254: 20.07,57.96 U$1.28 20.1,57.92 20.1,54.9 19.79,54.59 v14.3,54.59
  Bottom 0.254: v14.3,54.59 6.81,54.59 6.17,53.94 6.17,50.04 6.17,49.87 6.17,46.81 5.84,46.48 3.83,46.48 X2.5
LED_G  (via drill 0.3 pad 0.55)
  Top 0.254: v14.3,53.57 22.17,53.57 22.6,54 U$1.27
  Bottom 0.254: v14.3,53.57 7.22,53.57 6.68,53.03 6.68,47.24 6.68,47 6.68,44.78 5.99,44.09 X2.4
LED_R  (via drill 0.3 pad 0.55)
  Top 0.254: v14.3,52.56 24.56,52.56 25.14,53.14 U$1.26
  Bottom 0.254: v14.3,52.56 14.25,52.51 7.98,52.51 7.18,51.72 7.18,41.98 6.6,41.4 3.83,41.4 X2.3
N$1  (via drill 0.3 pad 0.55)
  Top 1.27: v115.32,39.62 115.32,46.48 116.33,47.5 115.32,48.51 112.78,45.97 112.78,46.24 Q12.4
  Bottom 1.27: v115.32,39.62 115.32,17.02 113.79,15.49 100.84,15.49 95.76,20.57 95.76,24.06 FS_PC.1
N$2
  Top 0.254: IC2.2 IC2.3 28.07,13.34 28.45,13.72 29.46,13.72 29.98,13.2 29.98,10.87 29.97,10.85 29.97,4.57 30.48,4.06 37.61,4.06 M1.CN2-26
N$3  (via drill 0.3 pad 0.55)
  Top 0.254: IC3.2 35.81,12.01 | 35.81,12.01 IC3.3 | v33.52,13.72 35.56,13.72 35.81,13.46 35.81,12.01
  Bottom 0.254: M1.CN3-18 28.7,27.18 28.96,26.92 31.89,26.92 32.39,26.42 32.39,24.69 33.52,23.56 v33.52,13.72
N$4  (via drill 0.3 pad 0.55)
  Top 0.254: IC4.3 IC4.2 17.91,13.34 17.53,13.72 v15.75,13.72
  Bottom 0.254: v15.75,13.72 18.29,13.72 18.54,13.97 M1.CN3-9
N$5  (via drill 0.3 pad 0.55)
  Top 0.254: R1.1 R9.2 v10.92,7.37
  Bottom 0.254: M1.CN2-10 18.54,7.1 18.02,7.62 11.18,7.62 v10.92,7.37
N$6
  Bottom 1.27: Q7.4 63.06,30.73 55.27,22.94 FS_SER.1
N$7
  Top 0.254: R2.1 R10.2 27.32,4.17 M1.CN2-17
N$8
  Top 0.254: IC2.1 25.53,9.66 R2.2 25.38,9.51 R6.1
N$9
  Top 0.254: IC3.1 34.42,9.66 R3.2 34.27,9.51 R7.1
N$10  (via drill 0.3 pad 0.55)
  Top 0.254: R3.1 36.21,9.4 | 36.21,9.4 R11.2 | v37.59,9.65 37.34,9.4 36.21,9.4
  Bottom 0.254: M1.CN3-25 37.59,24.4 v37.59,9.65
N$11  (via drill 0.3 pad 0.55)
  Top 0.254: R12.2 R4.1 v19.81,9.4
  Bottom 0.254: v19.81,9.4 19.81,26.67 20.07,26.92 25.91,26.92 26.16,27.18 M1.CN3-16
N$12
  Top 0.254: R8.1 16.49,9.26 R4.2 16.63,12 IC4.1
N$14
  Top 0.254: IC2.4 29.34,10.54 28.7,9.91 M1.CN2-18
N$15  (via drill 0.3 pad 0.55)
  Top 0.254: v38.61,13.97 38.23,13.59 IC3.4
  Bottom 0.254: M1.CN3-26 40.64,26.43 40.64,14.22 40.39,13.97 v38.61,13.97
N$16  (via drill 0.3 pad 0.55)
  Top 0.254: v21.59,11.43 21.03,11.43 IC4.4
  Bottom 0.254: M1.CN3-17 28.7,11.68 28.45,11.43 v21.59,11.43
N$17
  Top 0.305: Q10.2 79.1,4.25 72.71,4.25 72.37,4.59 Q8.4
  Top 1.27: Q8.4 72.63,14.21 101,14.21 BATT_3.+
N$18  (via drill 0.3 pad 0.55)
  Top 0.305: Q11.2 93.99,1.54 95,2.55 95,6.86 Q9.4
  Top 1.27: BATT_4.+ 103.38,31.24 104.39,32.26 v107.19,32.26 | v112.27,32.26 112.27,6.35 111.25,5.33 96.52,5.33 95,6.86
  Bottom 1.27: v107.19,32.26 v112.27,32.26
N$22
  Top 0.305: Q10.1 81.58,3.51 | Q11.1 84.65,0.83 84.33,0.51 80.01,0.51 79.76,0.76 79.76,2.29 80.01,2.54 81.53,2.54 81.79,2.79 81.79,3.46 Q10.1 | Q10.1 82.76,3.51 83.14,3.89 R40.2
N$23
  Top 0.508: SW_PC.1 109.23,55.12 109.23,54.87 | 103.89,49.53 Q12.1
  Top 0.813: Q12.1 106.17,49.53 | 106.17,49.53 106.68,49.02 | 106.68,49.02 106.68,43.69 102.11,39.12 93.98,39.12 93.22,38.35 93.22,27.69 92.46,26.92 89.41,26.92 88.33,25.84 R41.2 | 106.68,49.02 106.68,50.04 | 106.68,50.04 106.68,52.58 109.22,55.12 109.23,55.12 | 106.68,50.04 106.17,49.53
N$24  (via drill 0.3 pad 0.55)
  Top 0.254: v78.99,37.08 79.25,37.34 79.25,44.45 78.49,45.21 PWR.1
  Bottom 0.254: Q7.1 79.55,36.53 v78.99,37.08
  Bottom 0.813: Q7.1 79.55,30.5 R43.2
N$25
  Top 0.61: LED_PC.C 104.38,55.64 R42.2
N$26
  Top 0.254: R44.2 LED_SERVO.C
N$27
  Bottom 0.813: R45.1 R46.2 90.02,14.76 IC6.4
N$28
  Bottom 0.813: IC6.2 86.94,19.35 D1.C 85.98,20.32 78.49,20.32 73.79,15.62 73.79,8.38 75.06,7.11 L1.2
RE1  (via drill 0.3 pad 0.55)
  Top 0.254: IC1.2 IC1.3 10.41,12.14 10.41,13.46 10.67,13.72 11.94,13.72 12.21,13.45 12.21,10.87 12.19,10.85 12.19,9.4 14.98,6.61 v15.29,6.61
  Bottom 0.254: v15.29,6.61 15.04,6.61 14.73,6.3 14.73,0.76 14.86,0.64 26.04,0.64 26.16,0.76 M1.CN2-15
RESET  (via drill 0.3 pad 0.55)
  Top 0.254: U$1.16 v50.54,55.15 50.54,51.73 49.24,50.44 43.18,50.44 X1.1
  Bottom 0.254: v50.54,55.15 14.81,55.15 14.41,55.54 6.99,55.54 3.68,52.23 X2.7
RO1
  Top 0.254: IC1.1 R1.2 5.85,9.4 R5.1
RX_3V3
  Bottom 0.203: 12.95,31.75 26.67,31.75 27.68,32.76 U$1.6
  Bottom 0.254: U2.LV2 11.94,32.77 12.83,31.88 12.95,31.75
RX_5V
  Top 0.254: U2.HV2 11.94,45.47 13.08,44.32 IC5.1
SCL
  Top 0.254: U$2.SCL 67.06,32.77 66.04,31.75 48.68,31.75 48,32.43 U$1.14
SDA
  Top 0.254: U$1.11 40.38,31.76 41.15,30.99 68.58,30.99 69.85,32.26 69.85,38.86 U$2.SDA
STP  (via drill 0.3 pad 0.55)
  Top 0.254: U$1.20 40.64,57.7 40.64,52.14 40.05,51.55 v14.3,51.55
  Bottom 0.254: v14.3,51.55 14.25,51.6 8.68,51.6 7.69,50.61 7.69,39.44 7.11,38.86 3.83,38.86 X2.2
STT  (via drill 0.3 pad 0.55)
  Top 0.254: U$1.19 42.93,57.96 42.93,51.33 42.14,50.54 v14.23,50.54
  Bottom 0.254: v14.23,50.54 8.64,50.54 8.2,50.1 8.2,37.41 7.26,36.47 X2.1
TX_3V3
  Bottom 0.203: 10.41,30.99 29.28,30.99 30.22,31.93 U$1.7
  Bottom 0.254: U2.LV1 9.4,32 10.41,30.99
TX_5V
  Top 0.254: IC5.4 10.29,40.51 9.4,41.4 U2.HV1
VCC  (via drill 0.55)
  Top 0.254: R15.2 R22.2 31.1,21.73 31.5,21.34 31.5,20.83 | R19.2 R24.2 22.21,21.73 22.35,21.59 22.35,18.29 21.34,17.27 21.34,14.99 | 7.75,15.11 IC1.8 7.75,17.14 4.83,20.07 4.83,30.18 7.64,33 7.64,49.11 8.31,49.78 13.3,49.78 | 12.7,14.99 7.87,14.99 7.75,15.11 | 12.7,14.99 14.73,14.99 | 14.73,14.99 16.51,14.99 | 16.51,14.99 21.34,14.99 | 21.34,14.99 23.62,14.99 | 23.62,14.99 25.65,14.99 | 25.65,14.99 30.48,14.99 | 30.48,14.99 32.51,14.99 | 32.51,14.99 34.04,14.99 34.42,15.37 IC3.8 | 30.48,14.99 30.48,17.53 31.5,18.54 31.5,20.83 | 39.74,21.73 R23.2 R17.2 36.83,21.34 36.32,20.83 31.5,20.83 | 12.7,14.99 12.7,17.78 13.72,18.8 13.72,21.34 13.32,21.73 R21.2 R13.2 10.16,24.91 M1.CN3-3 M1.CN3-1 | IC4.8 16.64,15.11 16.51,14.99 | IC2.8 25.53,15.11 25.65,14.99 | R5.2 5.84,12.19 7.75,14.1 7.75,15.11 | R6.2 23.62,14.99 | R8.2 14.73,14.99 | R7.2 32.51,14.99 | 14.47,49.78 14.47,47.76 U2.HV | R27.2 R25.2 37.34,42.93 37.59,43.18 37.59,46.23 37.34,46.48 35.94,46.48 35.56,46.86 35.56,49.53 35.31,49.78 31.93,49.78 | IC5.8 v31.93,48.26 31.93,49.61 | 31.93,49.61 31.93,49.78 | 31.75,49.78 31.93,49.78 | 13.3,49.78 14.47,49.78 | 14.47,49.78 31.75,49.78 | X1.3 48.26,44.96 | 13.3,49.78 13.3,57.2 14.07,57.97 U$1.30 | 31.75,49.78 31.93,49.61
  Top 0.508: U$2.VIN 77.22,39.88 76.45,40.64 49.02,40.64 48.26,41.4 48.26,44.96
  Bottom 0.508: U$2.VIN 76.71,38.61 76.71,25.65 77.47,24.89 84.33,24.89 | X1.3 48.01,44.96 48.01,48.01 47.5,48.51 32.18,48.51 v31.93,48.26
  Bottom 0.813: L1.1 71.25,15.11 79.63,23.49 79.63,23.5 81.02,24.89 84.33,24.89 84.68,24.89 R45.2 84.94,28.8 86.15,30.02 C2.+
  Bottom 1.016: C2.+ 87.57,30.04
VCC_PC
  Top 0.508: PC.+ 94.48,45.96 95.76,47.24 99.31,47.24 99.82,47.75 99.82,53.59 100.08,53.85 106.17,53.85 106.47,54.14 LED_PC.A 106.43,55.58 106.43,55.37
  Bottom 1.27: V_PC.1 93.27,56.59 94.49,55.37 PC.+ | PC.+ | FS_PC.3 95.33,42.61 PC.+
VDD
  Top 0.254: 64.25,0.78 64.14,0.89 J6.2
  Top 0.305: LED_SERVO.A 77.76,1.3 77.34,0.89 64.14,0.89
  Bottom 1.27: 48.51,4.83 J4.2 J7.2 J3.2 48.51,22.1 47.67,22.94 FS_SER.3 | 48.51,4.83 J8.2 | J1.2 J5.2 J2.2 62.74,4.83 | 62.74,4.83 J6.2 | 62.74,4.83 48.51,4.83

### Text on the board
tPlace: + | - | BUS 3 | BUS 1 | BUS 4 | BUS 2
tNames: Dynamixel Controller | Powerswitch
bNames: Dynamixel Motor Controller / Designed by Andreas and Zidane